# Altium schematic sheet 7.3 VA_PRORECT LATCH AND CLEAR.SchDoc
size A3
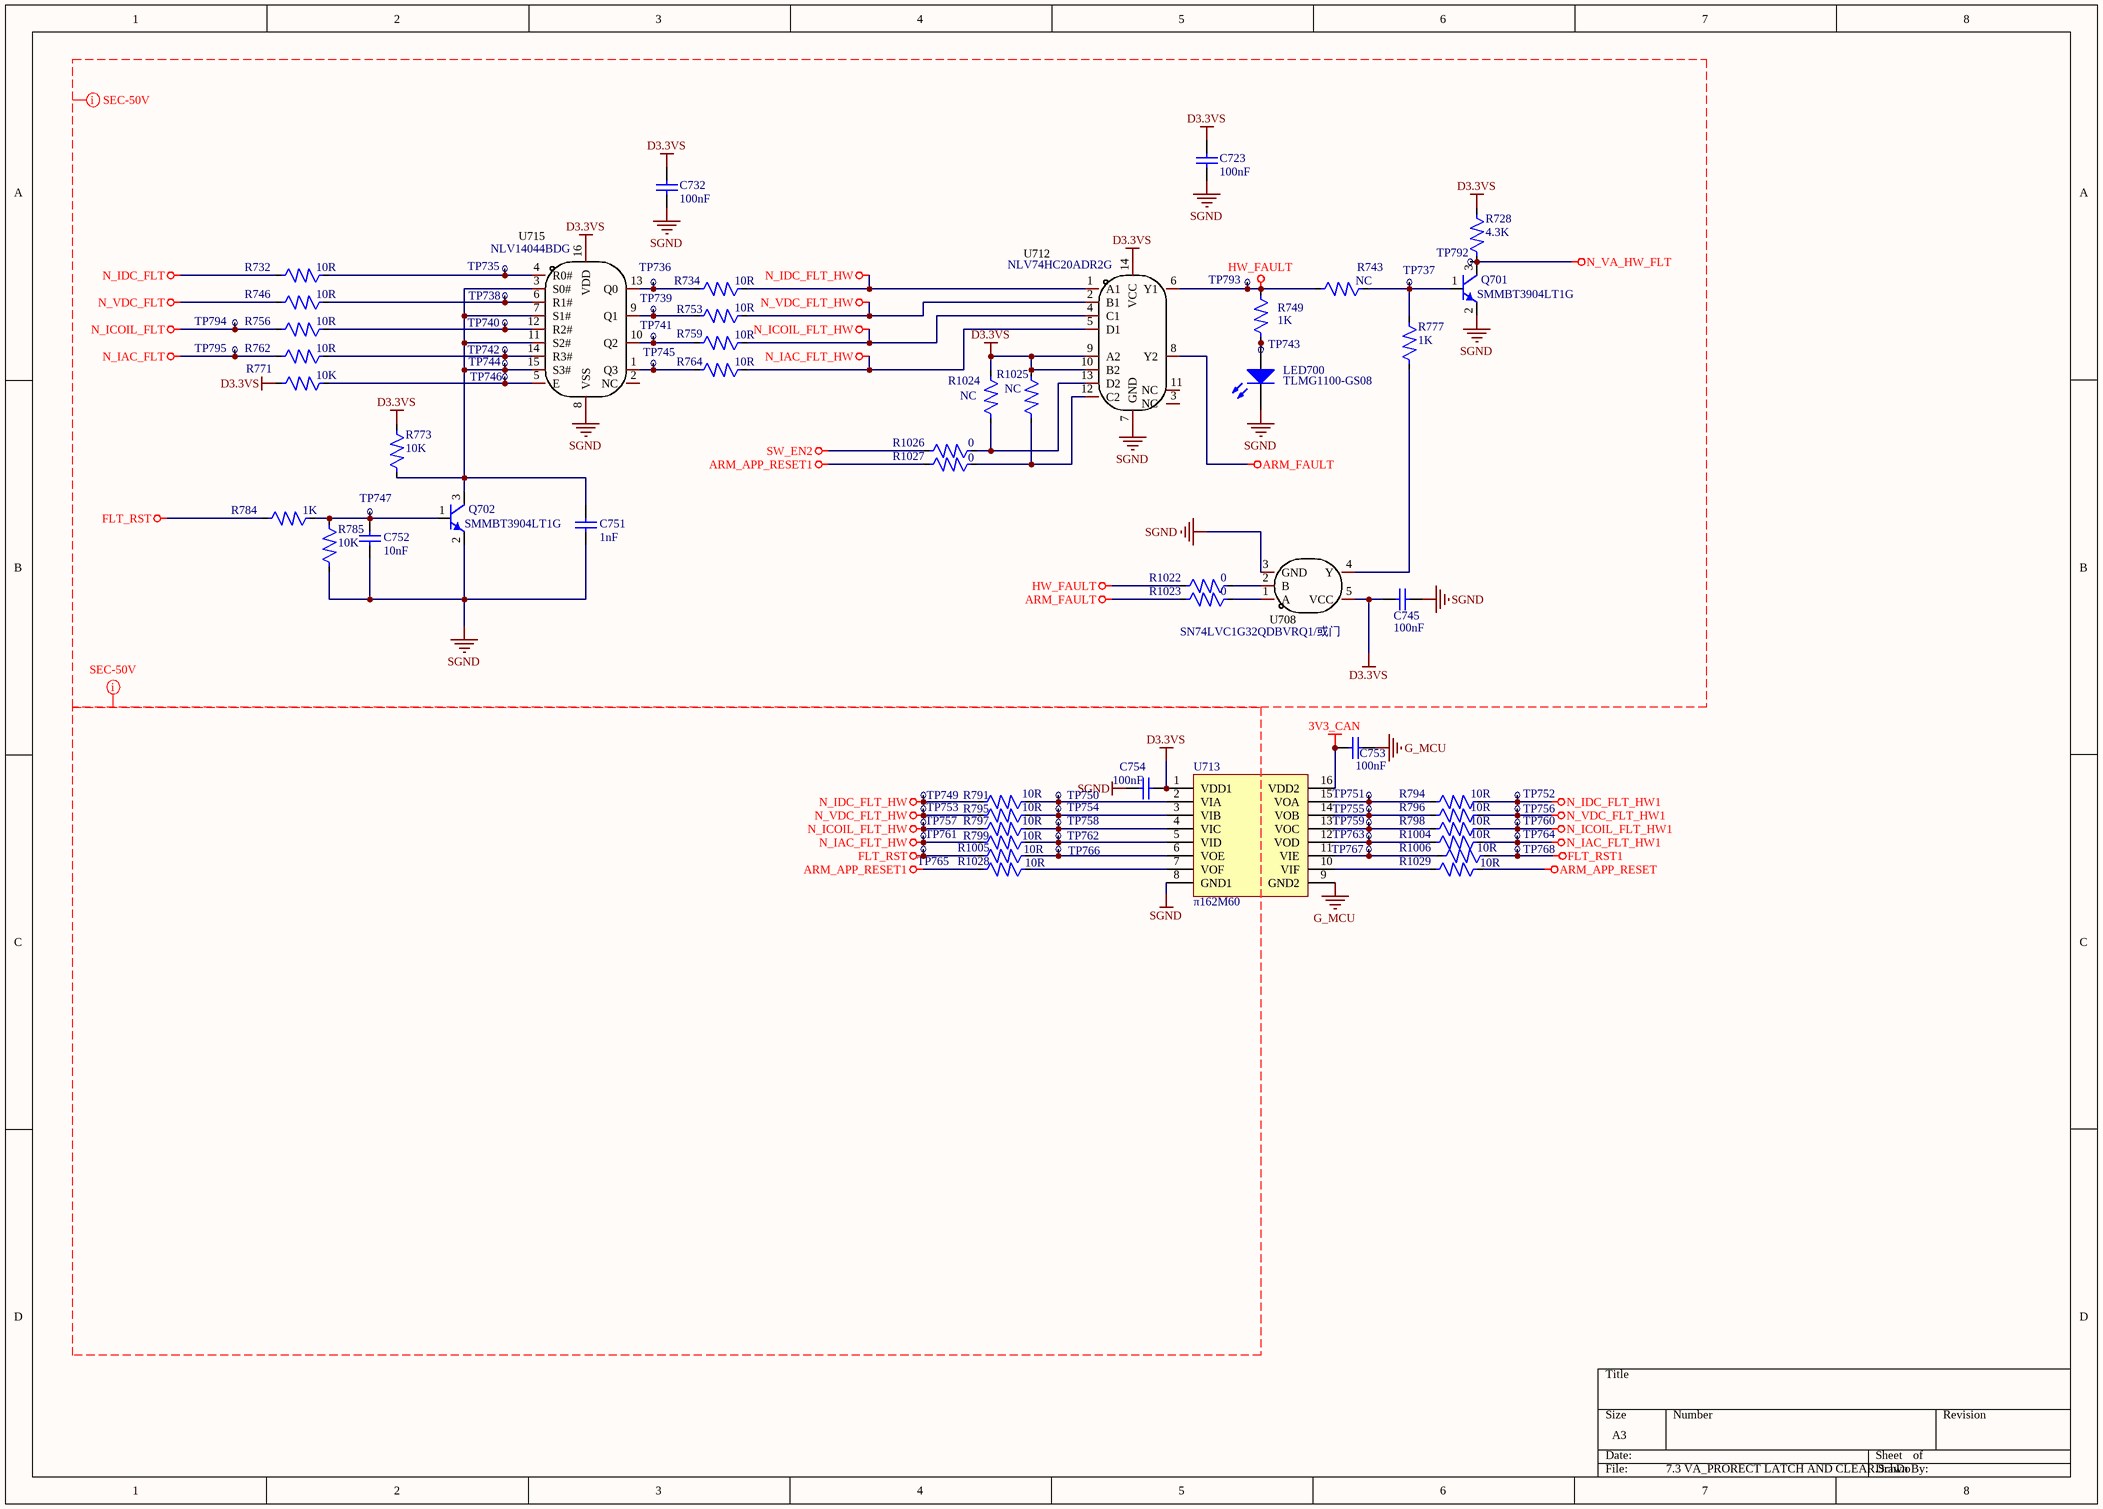
[diagram p0: 7.3 VA_PRORECT LATCH AND CLEAR.SchDoc]

## Parts
C723  100nF  [C0402]
C732  100nF  [C0402]
C745  100nF  [C0402]
C751  1nF  [C0402]
C752  10nF  [C0402]
C753  100nF  [C0402]
C754  100nF  [C0402]
LED700  TLMG1100-GS08  [LED_0603]
Q701  SMMBT3904LT1G  [SOT-23-3]
Q702  SMMBT3904LT1G  [SOT-23-3]
R728  4.3K  [R0402]
R732  10R  [R0402]
R734  10R  [R0402]
R743  NC  [R0402]
R746  10R  [R0402]
R749  1K  [R0402]
R753  10R  [R0402]
R756  10R  [R0402]
R759  10R  [R0402]
R762  10R  [R0402]
R764  10R  [R0402]
R771  10K  [R0402]
R773  10K  [R0402]
R777  1K  [R0402]
R784  1K  [R0402]
R785  10K  [R0402]
R791  10R  [R0402]
R794  10R  [R0402]
R795  10R  [R0402]
R796  10R  [R0402]
R797  10R  [R0402]
R798  10R  [R0402]
R799  10R  [R0402]
R1004  10R  [R0402]
R1005  10R  [R0402]
R1006  10R  [R0402]
R1022  0  [R0402]
R1023  0  [R0402]
R1024  NC  [R0402]
R1025  NC  [R0402]
R1026  0  [R0402]
R1027  0  [R0402]
R1028  10R  [R0402]
R1029  10R  [R0402]
TP735  测试点  [测试点]  (value not drawn)
TP736  测试点  [测试点]  (value not drawn)
TP737  测试点  [测试点]  (value not drawn)
TP738  测试点  [测试点]  (value not drawn)
TP739  测试点  [测试点]  (value not drawn)
TP740  测试点  [测试点]  (value not drawn)
TP741  测试点  [测试点]  (value not drawn)
TP742  测试点  [测试点]  (value not drawn)
TP743  测试点  [测试点]  (value not drawn)
TP744  测试点  [测试点]  (value not drawn)
TP745  测试点  [测试点]  (value not drawn)
TP746  测试点  [测试点]  (value not drawn)
TP747  测试点  [测试点]  (value not drawn)
TP749  测试点  [测试点]  (value not drawn)
TP750  测试点  [测试点]  (value not drawn)
TP751  测试点  [测试点]  (value not drawn)
TP752  测试点  [测试点]  (value not drawn)
TP753  测试点  [测试点]  (value not drawn)
TP754  测试点  [测试点]  (value not drawn)
TP755  测试点  [测试点]  (value not drawn)
TP756  测试点  [测试点]  (value not drawn)
TP757  测试点  [测试点]  (value not drawn)
TP758  测试点  [测试点]  (value not drawn)
TP759  测试点  [测试点]  (value not drawn)
TP760  测试点  [测试点]  (value not drawn)
TP761  测试点  [测试点]  (value not drawn)
TP762  测试点  [测试点]  (value not drawn)
TP763  测试点  [测试点]  (value not drawn)
TP764  测试点  [测试点]  (value not drawn)
TP765  测试点  [测试点]  (value not drawn)
TP766  测试点  [测试点]  (value not drawn)
TP767  测试点  [测试点]  (value not drawn)
TP768  测试点  [测试点]  (value not drawn)
TP792  测试点  [测试点]  (value not drawn)
TP793  测试点  [测试点]  (value not drawn)
TP794  测试点  [测试点]  (value not drawn)
TP795  测试点  [测试点]  (value not drawn)
U708  SN74LVC1G32QDBVRQ1/或门  [SOT23-5]
U712  NLV74HC20ADR2G  [PG_D_SO_14]
U713  π162M60  [SOIC_W_16]
U715  NLV14044BDG  [SOIC_16_D]

## Nets
3V3_CAN: C753.2 U713.16(VDD2)
ARM_APP_RESET: R1029.1
ARM_APP_RESET1: R1027.2 R1028.2
ARM_FAULT: R1023.2 U712.8(Y2)
D3.3VS: C723.1 C732.1 C745.1 C754.1 R728.1 R771.1 R773.1 R1024.1 R1025.1 U708.5(VCC) U712.9(A2) U712.10(B2) U712.14(VCC) U713.1(VDD1) U715.16(VDD)
FLT_RST: R784.2 R1005.2 TP765.1
FLT_RST1: R1006.1 TP768.1
G_MCU: C753.1 U713.9(GND2)
HW_FAULT: R743.2 R749.1 R1022.2 TP793.1 U712.6(Y1)
N_IAC_FLT: R762.2 TP795.1
N_IAC_FLT_HW: R764.1 R799.2 TP761.1 U712.5(D1)
N_IAC_FLT_HW1: R1004.1 TP764.1
N_ICOIL_FLT: R756.2 TP794.1
N_ICOIL_FLT_HW: R759.1 R797.2 TP757.1 U712.4(C1)
N_ICOIL_FLT_HW1: R798.1 TP760.1
N_IDC_FLT: R732.2
N_IDC_FLT_HW: R734.1 R791.2 TP749.1 U712.1(A1)
N_IDC_FLT_HW1: R794.1 TP752.1
N_VA_HW_FLT: Q701.3(C) R728.2 TP792.1
N_VDC_FLT: R746.2
N_VDC_FLT_HW: R753.1 R795.2 TP753.1 U712.2(B1)
N_VDC_FLT_HW1: R796.1 TP756.1
SGND: C723.2 C732.2 C745.2 C751.1 C752.1 C754.2 LED700.2(K) Q701.2(E) Q702.2(E) R785.2 U708.3(GND) U712.7(GND) U713.8(GND1) U715.8(VSS)
SW_EN2: R1026.2
NetC751_2: C751.2 Q702.3(C) R773.2 TP744.1 U715.3(S0#) U715.7(S1#) U715.11(S2#) U715.15(S3#)
NetC752_2: C752.2 Q702.1(B) R784.1 R785.1 TP747.1
NetLED700_1: LED700.1(A) R749.2 TP743.1
NetQ701_1: Q701.1(B) R743.1 R777.1 TP737.1
NetR732_1: R732.1 TP735.1 U715.4(R0#)
NetR734_2: R734.2 TP736.1 U715.13(Q0)
NetR746_1: R746.1 TP738.1 U715.6(R1#)
NetR753_2: R753.2 TP739.1 U715.9(Q1)
NetR756_1: R756.1 TP740.1 U715.12(R2#)
NetR759_2: R759.2 TP741.1 U715.10(Q2)
NetR762_1: R762.1 TP742.1 U715.14(R3#)
NetR764_2: R764.2 TP745.1 U715.1(Q3)
NetR771_2: R771.2 TP746.1 U715.5(E)
NetR777_2: R777.2 U708.4(Y)
NetR791_1: R791.1 TP750.1 U713.2(VIA)
NetR794_2: R794.2 TP751.1 U713.15(VOA)
NetR795_1: R795.1 TP754.1 U713.3(VIB)
NetR796_2: R796.2 TP755.1 U713.14(VOB)
NetR797_1: R797.1 TP758.1 U713.4(VIC)
NetR798_2: R798.2 TP759.1 U713.13(VOC)
NetR799_1: R799.1 TP762.1 U713.5(VID)
NetR1004_2: R1004.2 TP763.1 U713.12(VOD)
NetR1005_1: R1005.1 TP766.1 U713.6(VOE)
NetR1006_2: R1006.2 TP767.1 U713.11(VIE)
NetR1022_1: R1022.1 U708.2(B)
NetR1023_1: R1023.1 U708.1(A)
NetR1024_2: R1024.2 R1026.1 U712.13(D2)
NetR1025_2: R1025.2 R1027.1 U712.12(C2)
NetR1028_1: R1028.1 U713.7(VOF)
NetR1029_2: R1029.2 U713.10(VIF)

Not connected (* = marked no-connect by the designer): U712 3(NC) 11(NC); U715 2(NC)

## Layout directives
net class SEC-50V: ARM_APP_RESET1, ARM_FAULT, D3.3VS, FLT_RST, HW_FAULT, N_IAC_FLT, N_IAC_FLT_HW, N_ICOIL_FLT, N_ICOIL_FLT_HW, N_IDC_FLT, N_IDC_FLT_HW, N_VA_HW_FLT, N_VDC_FLT, N_VDC_FLT_HW, SGND, SW_EN2

## Library data of the parts
C723 C732 C745 C753 C754 = Cap: Manufacturer: Yageo; Manufacturer P/N: AC0402KRX7R9BB104; DIP/SMD: SMD
C751 C752 = CAP
  C751: value: 1nF
  C752: value: 10nF
LED700 = LED1
Q701 Q702 = NPN
R728 R732 R734 R743 R746 R749 R753 R756 R759 R762 R764 R771 R773 R777 R784 R785 R791 R794-R799 R1004-R1006 R1022-R1029 = RESISTOR_0805: Manufacturer: Yageo; Manufacturer P/N: AC0402FR-07330RL; DIP/SMD: SMD
U708 = SN74LVC1G08QDBVRQ1: Manufacturer: TI(德州仪器); Add into BOM: yes; Logic Gate Type: 与门; Number of Channels: 1; Supply Voltage: 1.65V~5.5V; Quiescent Current (Max): 10uA; Sink Current: 32mA; Propagation Delay Time: 6ns@5V,50pF; Name: SN74LVC1G08QDBVRQ1; Symbol: SN74LVC1G08QDBVRQ1; Device: SN74LVC1G08QDBVRQ1; LCSC Part Name: 与门; Supplier Part: C840098; Manufacturer Part: SN74LVC1G08QDBVRQ1; Supplier Footprint: SOT-23-5; JLCPCB Part Class: Extended Part; Datasheet: https://atta.szlcsc.com/upload/public/pdf/source/20230221/58A14714C9A397E2ED89934BF2BCABE9.pdf; Supplier: LCSC; Convert to PCB: yes; Series: 74LVC; Source Current: 32mA; Operating Temperature: -40℃~+125℃
U712 = NLV74HC20ADR2G: Manufacturer: onsemi(安森美); Add into BOM: yes; Name: NLV74HC20ADR2G; Symbol: NLV74HC20ADR2G; Device: NLV74HC20ADR2G; LCSC Part Name: NLV74HC20ADR2G; Supplier Part: C904856; Manufacturer Part: NLV74HC20ADR2G; Supplier Footprint: SOIC-14; JLCPCB Part Class: Extended Part; Datasheet: https://atta.szlcsc.com/upload/public/pdf/source/20210722/C904856_8C97A59DEACF0512DD8FD73EFFA0734F.pdf; Supplier: LCSC; Convert to PCB: yes
U713 = 162xxx
U715 = NLV14044BDG: Manufacturer: onsemi(安森美); Add into BOM: yes; Name: NLV14044BDG; Symbol: NLV14044BDG; Device: NLV14044BDG; LCSC Part Name: $CLEAR$ 四路 R-S 锁存; Supplier Part: C906904; Manufacturer Part: NLV14044BDG; Supplier Footprint: SOIC-16; JLCPCB Part Class: Extended Part; Datasheet: https://atta.szlcsc.com/upload/public/pdf/source/20181108/C233502_B40CCB3BC27A45D6E7C5F90816B6C004.pdf; Supplier: LCSC; Convert to PCB: yes